# Altium schematic sheet motherboard.SchDoc
size A4; DocumentNumber: P21; SheetNumber: 1; SheetTotal: 5
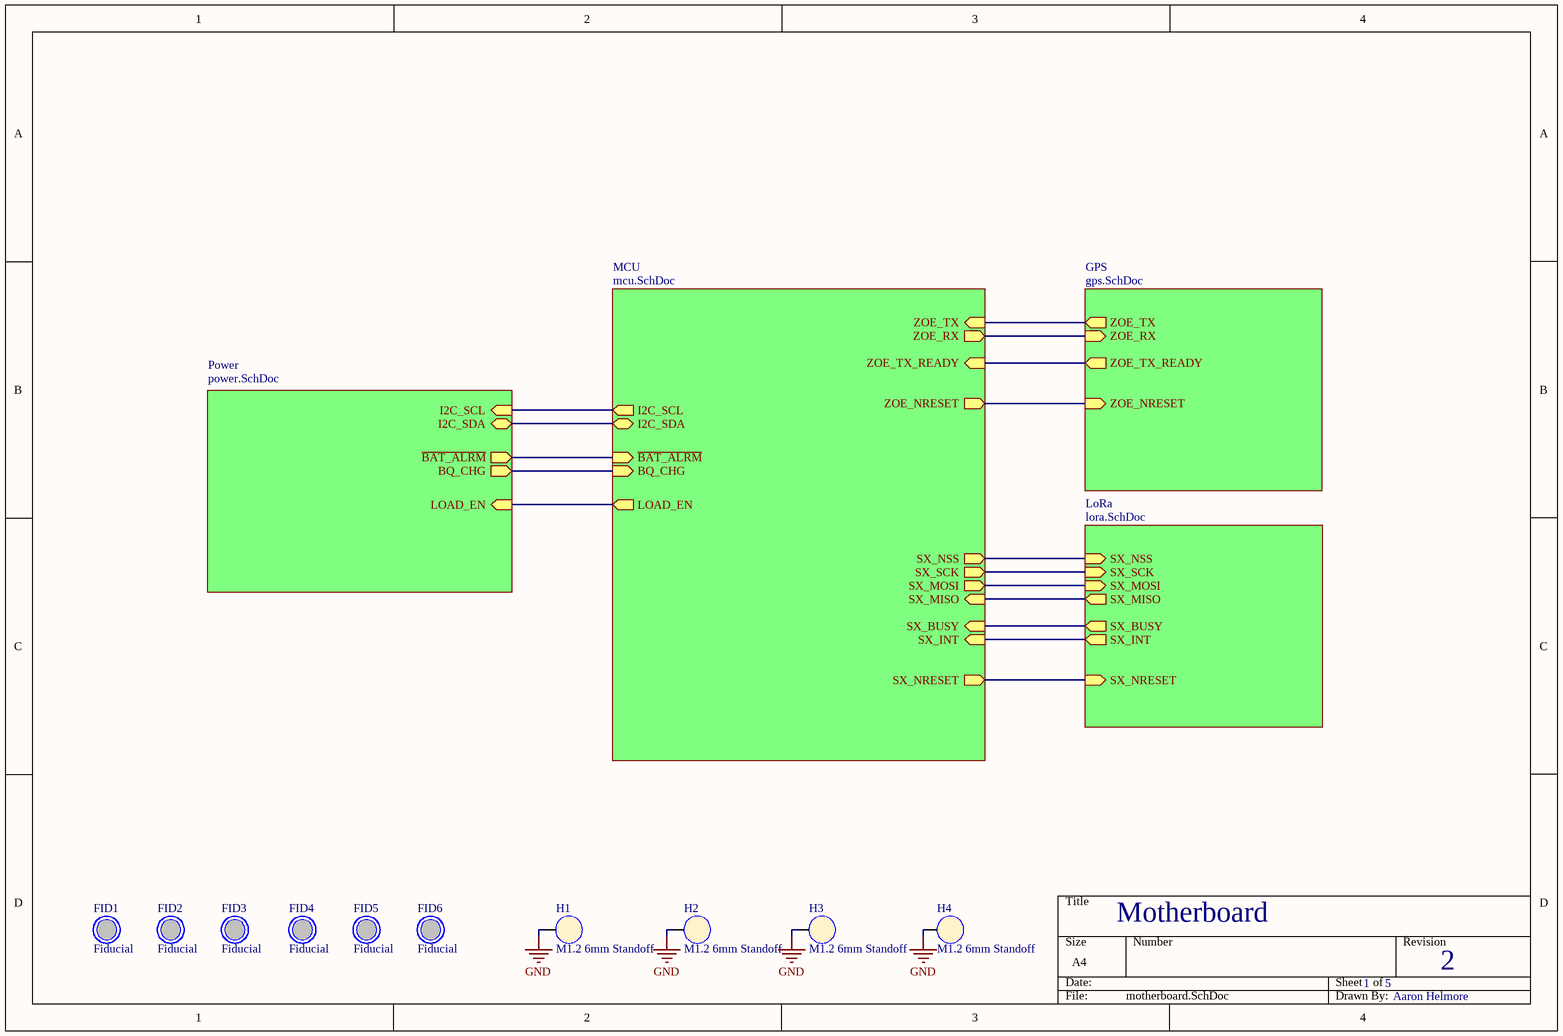
[diagram p0: motherboard.SchDoc]

## Parts
FID1  Fiducial  [FIDUCIAL_0.5MM_SOLDER_1MM_MASK]
FID2  Fiducial  [FIDUCIAL_0.5MM_SOLDER_1MM_MASK]
FID3  Fiducial  [FIDUCIAL_0.5MM_SOLDER_1MM_MASK]
FID4  Fiducial  [FIDUCIAL_0.5MM_SOLDER_1MM_MASK]
FID5  Fiducial  [FIDUCIAL_0.5MM_SOLDER_1MM_MASK]
FID6  Fiducial  [FIDUCIAL_0.5MM_SOLDER_1MM_MASK]
H1  M1.2 6mm Standoff  [M1.2_6mm_STANDOFF]
H2  M1.2 6mm Standoff  [M1.2_6mm_STANDOFF]
H3  M1.2 6mm Standoff  [M1.2_6mm_STANDOFF]
H4  M1.2 6mm Standoff  [M1.2_6mm_STANDOFF]

## Sub-sheets
GPS = gps.SchDoc: ZOE_TX (out), ZOE_RX (in), ZOE_TX_READY (out), ZOE_NRESET (in)
LoRa = lora.SchDoc: SX_NSS (in), SX_SCK (in), SX_MOSI (in), SX_MISO (out), SX_BUSY (out), SX_NRESET (in), SX_INT (out)
MCU = mcu.SchDoc: LOAD_EN (out), BQ_CHG (in), ~{BAT_ALRM} (in), I2C_SCL (out), I2C_SDA (bidir), ZOE_TX (in), ZOE_RX (out), ZOE_TX_READY (in), ZOE_NRESET (out), SX_NRESET (out), SX_NSS (out), SX_MOSI (out), SX_SCK (out), SX_MISO (in), SX_BUSY (in), SX_INT (in)
Power = power.SchDoc: BQ_CHG (out), LOAD_EN (in), ~{BAT_ALRM} (out), I2C_SCL (in), I2C_SDA (bidir)

## Nets
GND: H1.1(VCC) H2.1(VCC) H3.1(VCC) H4.1(VCC)
(unnamed): sheet MCU/LOAD_EN, sheet Power/LOAD_EN
(unnamed): sheet MCU/BQ_CHG, sheet Power/BQ_CHG
(unnamed): sheet MCU/~{BAT_ALRM}, sheet Power/~{BAT_ALRM}
(unnamed): sheet MCU/I2C_SCL, sheet Power/I2C_SCL
(unnamed): sheet MCU/I2C_SDA, sheet Power/I2C_SDA
(unnamed): sheet MCU/ZOE_TX, sheet GPS/ZOE_TX
(unnamed): sheet MCU/ZOE_RX, sheet GPS/ZOE_RX
(unnamed): sheet MCU/ZOE_TX_READY, sheet GPS/ZOE_TX_READY
(unnamed): sheet MCU/ZOE_NRESET, sheet GPS/ZOE_NRESET
(unnamed): sheet MCU/SX_NRESET, sheet LoRa/SX_NRESET
(unnamed): sheet MCU/SX_NSS, sheet LoRa/SX_NSS
(unnamed): sheet MCU/SX_MOSI, sheet LoRa/SX_MOSI
(unnamed): sheet MCU/SX_SCK, sheet LoRa/SX_SCK
(unnamed): sheet MCU/SX_MISO, sheet LoRa/SX_MISO
(unnamed): sheet MCU/SX_BUSY, sheet LoRa/SX_BUSY
(unnamed): sheet MCU/SX_INT, sheet LoRa/SX_INT

## Notes on the sheet
- Motherboard
- 1
- 5
- 2
- Aaron Helmore